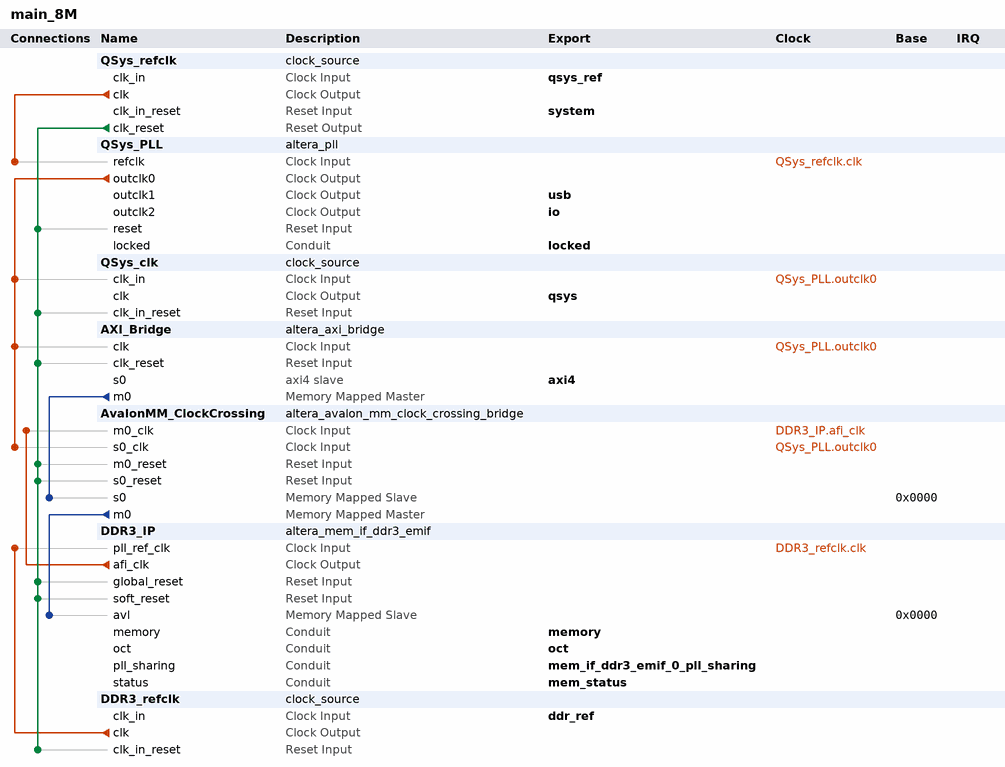
[diagram p0: system contents]
# Platform Designer (Qsys) system main_8M, Stratix V 5SGXEA7N2F45C2
# Parameters at their usual value, and those the tool derives, are not listed.
package require -exact qsys 20.1
create_system main_8M
set_project_property DEVICE_FAMILY {Stratix V}
set_project_property DEVICE 5SGXEA7N2F45C2

add_instance QSys_refclk clock_source 20.1
set_instance_parameter_value QSys_refclk clockFrequency 50000000

add_instance QSys_PLL altera_pll 20.1
set_instance_parameter_value QSys_PLL gui_device_speed_grade 1
set_instance_parameter_value QSys_PLL gui_number_of_clocks 3
set_instance_parameter_value QSys_PLL gui_operation_mode direct
set_instance_parameter_value QSys_PLL gui_output_clock_frequency0 8.0
set_instance_parameter_value QSys_PLL gui_output_clock_frequency1 48.0
set_instance_parameter_value QSys_PLL gui_output_clock_frequency2 8.0
set_instance_parameter_value QSys_PLL gui_pll_mode {Integer-N PLL}
set_instance_parameter_value QSys_PLL gui_reference_clock_frequency 50.0
set_instance_parameter_value QSys_PLL gui_use_locked true

add_instance QSys_clk clock_source 20.1
set_instance_parameter_value QSys_clk clockFrequency 50000000

add_instance AXI_Bridge altera_axi_bridge 20.1
set_instance_parameter_value AXI_Bridge ADDR_WIDTH 33
set_instance_parameter_value AXI_Bridge AXI_VERSION AXI4
set_instance_parameter_value AXI_Bridge COMBINED_ACCEPTANCE_CAPABILITY 16
set_instance_parameter_value AXI_Bridge COMBINED_ISSUING_CAPABILITY 16
set_instance_parameter_value AXI_Bridge DATA_WIDTH 32
set_instance_parameter_value AXI_Bridge M0_ID_WIDTH 4
set_instance_parameter_value AXI_Bridge READ_ACCEPTANCE_CAPABILITY 16
set_instance_parameter_value AXI_Bridge READ_ADDR_USER_WIDTH 32
set_instance_parameter_value AXI_Bridge READ_DATA_REORDERING_DEPTH 1
set_instance_parameter_value AXI_Bridge READ_DATA_USER_WIDTH 32
set_instance_parameter_value AXI_Bridge READ_ISSUING_CAPABILITY 16
set_instance_parameter_value AXI_Bridge S0_ID_WIDTH 4
set_instance_parameter_value AXI_Bridge USE_M0_ARBURST 1
set_instance_parameter_value AXI_Bridge USE_M0_ARCACHE 1
set_instance_parameter_value AXI_Bridge USE_M0_ARID 1
set_instance_parameter_value AXI_Bridge USE_M0_ARLEN 1
set_instance_parameter_value AXI_Bridge USE_M0_ARLOCK 1
set_instance_parameter_value AXI_Bridge USE_M0_ARQOS 1
set_instance_parameter_value AXI_Bridge USE_M0_ARREGION 0
set_instance_parameter_value AXI_Bridge USE_M0_ARSIZE 1
set_instance_parameter_value AXI_Bridge USE_M0_ARUSER 0
set_instance_parameter_value AXI_Bridge USE_M0_AWBURST 1
set_instance_parameter_value AXI_Bridge USE_M0_AWCACHE 1
set_instance_parameter_value AXI_Bridge USE_M0_AWID 1
set_instance_parameter_value AXI_Bridge USE_M0_AWLEN 1
set_instance_parameter_value AXI_Bridge USE_M0_AWLOCK 1
set_instance_parameter_value AXI_Bridge USE_M0_AWQOS 1
set_instance_parameter_value AXI_Bridge USE_M0_AWREGION 0
set_instance_parameter_value AXI_Bridge USE_M0_AWSIZE 1
set_instance_parameter_value AXI_Bridge USE_M0_AWUSER 0
set_instance_parameter_value AXI_Bridge USE_M0_BID 1
set_instance_parameter_value AXI_Bridge USE_M0_BRESP 1
set_instance_parameter_value AXI_Bridge USE_M0_BUSER 0
set_instance_parameter_value AXI_Bridge USE_M0_RID 1
set_instance_parameter_value AXI_Bridge USE_M0_RLAST 1
set_instance_parameter_value AXI_Bridge USE_M0_RRESP 1
set_instance_parameter_value AXI_Bridge USE_M0_RUSER 0
set_instance_parameter_value AXI_Bridge USE_M0_WSTRB 1
set_instance_parameter_value AXI_Bridge USE_M0_WUSER 0
set_instance_parameter_value AXI_Bridge USE_PIPELINE 1
set_instance_parameter_value AXI_Bridge USE_S0_ARCACHE 1
set_instance_parameter_value AXI_Bridge USE_S0_ARLOCK 1
set_instance_parameter_value AXI_Bridge USE_S0_ARPROT 1
set_instance_parameter_value AXI_Bridge USE_S0_ARQOS 1
set_instance_parameter_value AXI_Bridge USE_S0_ARREGION 0
set_instance_parameter_value AXI_Bridge USE_S0_ARUSER 0
set_instance_parameter_value AXI_Bridge USE_S0_AWCACHE 1
set_instance_parameter_value AXI_Bridge USE_S0_AWLOCK 1
set_instance_parameter_value AXI_Bridge USE_S0_AWPROT 1
set_instance_parameter_value AXI_Bridge USE_S0_AWQOS 1
set_instance_parameter_value AXI_Bridge USE_S0_AWREGION 0
set_instance_parameter_value AXI_Bridge USE_S0_AWUSER 0
set_instance_parameter_value AXI_Bridge USE_S0_BRESP 1
set_instance_parameter_value AXI_Bridge USE_S0_BUSER 0
set_instance_parameter_value AXI_Bridge USE_S0_RRESP 1
set_instance_parameter_value AXI_Bridge USE_S0_RUSER 0
set_instance_parameter_value AXI_Bridge USE_S0_WLAST 1
set_instance_parameter_value AXI_Bridge USE_S0_WUSER 0
set_instance_parameter_value AXI_Bridge WRITE_ACCEPTANCE_CAPABILITY 16
set_instance_parameter_value AXI_Bridge WRITE_ADDR_USER_WIDTH 32
set_instance_parameter_value AXI_Bridge WRITE_DATA_USER_WIDTH 32
set_instance_parameter_value AXI_Bridge WRITE_ISSUING_CAPABILITY 16
set_instance_parameter_value AXI_Bridge WRITE_RESP_USER_WIDTH 32

add_instance AvalonMM_ClockCrossing altera_avalon_mm_clock_crossing_bridge 20.1
set_instance_parameter_value AvalonMM_ClockCrossing ADDRESS_WIDTH 10
set_instance_parameter_value AvalonMM_ClockCrossing COMMAND_FIFO_DEPTH 4
set_instance_parameter_value AvalonMM_ClockCrossing DATA_WIDTH 32
set_instance_parameter_value AvalonMM_ClockCrossing MASTER_SYNC_DEPTH 2
set_instance_parameter_value AvalonMM_ClockCrossing MAX_BURST_SIZE 1
set_instance_parameter_value AvalonMM_ClockCrossing RESPONSE_FIFO_DEPTH 4
set_instance_parameter_value AvalonMM_ClockCrossing SLAVE_SYNC_DEPTH 2
set_instance_parameter_value AvalonMM_ClockCrossing USE_AUTO_ADDRESS_WIDTH 1

add_instance DDR3_IP altera_mem_if_ddr3_emif 20.1
set_instance_parameter_value DDR3_IP AVL_MAX_SIZE 8
set_instance_parameter_value DDR3_IP CALIBRATION_MODE Skip
set_instance_parameter_value DDR3_IP CPORT_TYPE_PORT Bidirectional,Bidirectional,Bidirectional,Bidirectional,Bidirectional,Bidirectional
set_instance_parameter_value DDR3_IP EXPORT_AFI_HALF_CLK false
set_instance_parameter_value DDR3_IP HARD_EMIF false
set_instance_parameter_value DDR3_IP MEM_BANKADDR_WIDTH 3
set_instance_parameter_value DDR3_IP MEM_CK_WIDTH 2
set_instance_parameter_value DDR3_IP MEM_CLK_FREQ 800.0
set_instance_parameter_value DDR3_IP MEM_CLK_FREQ_MAX 1066.667
set_instance_parameter_value DDR3_IP MEM_COL_ADDR_WIDTH 10
set_instance_parameter_value DDR3_IP MEM_DQ_WIDTH 64
set_instance_parameter_value DDR3_IP MEM_FORMAT UNBUFFERED
set_instance_parameter_value DDR3_IP MEM_ROW_ADDR_WIDTH 16
set_instance_parameter_value DDR3_IP MEM_RTT_WR RZQ/2
set_instance_parameter_value DDR3_IP MEM_TCL 7
set_instance_parameter_value DDR3_IP MEM_TFAW_NS 37.5
set_instance_parameter_value DDR3_IP MEM_TRAS_NS 37.5
set_instance_parameter_value DDR3_IP MEM_TRCD_NS 13.125
set_instance_parameter_value DDR3_IP MEM_TRFC_NS 350.625
set_instance_parameter_value DDR3_IP MEM_TRP_NS 13.125
set_instance_parameter_value DDR3_IP MEM_TRRD_NS 7.5
set_instance_parameter_value DDR3_IP MEM_TRTP_NS 7.5
set_instance_parameter_value DDR3_IP MEM_TWTR 4
set_instance_parameter_value DDR3_IP MEM_VENDOR Hynix
set_instance_parameter_value DDR3_IP MEM_WTCL 6
set_instance_parameter_value DDR3_IP PLL_LOCATION Left_Right
set_instance_parameter_value DDR3_IP POWER_OF_TWO_BUS true
set_instance_parameter_value DDR3_IP PRIORITY_PORT 0,1,1,1,1,1
set_instance_parameter_value DDR3_IP RATE Quarter
set_instance_parameter_value DDR3_IP REF_CLK_FREQ 50.0
set_instance_parameter_value DDR3_IP SPEED_GRADE 2
set_instance_parameter_value DDR3_IP TIMING_BOARD_AC_SKEW 0.0176
set_instance_parameter_value DDR3_IP TIMING_BOARD_AC_TO_CK_SKEW -0.00115
set_instance_parameter_value DDR3_IP TIMING_BOARD_DQ_TO_DQS_SKEW -9.771E-4
set_instance_parameter_value DDR3_IP TIMING_BOARD_MAX_CK_DELAY 0.43458
set_instance_parameter_value DDR3_IP TIMING_BOARD_MAX_DQS_DELAY 0.433984
set_instance_parameter_value DDR3_IP TIMING_BOARD_SKEW_BETWEEN_DQS 0.098
set_instance_parameter_value DDR3_IP TIMING_BOARD_SKEW_CKDQS_DIMM_MAX 0.09856
set_instance_parameter_value DDR3_IP TIMING_BOARD_SKEW_CKDQS_DIMM_MIN -0.00279279
set_instance_parameter_value DDR3_IP TIMING_BOARD_SKEW_WITHIN_DQS 0.0069644
set_instance_parameter_value DDR3_IP TIMING_TDH 45
set_instance_parameter_value DDR3_IP TIMING_TDQSCK 255
set_instance_parameter_value DDR3_IP TIMING_TDQSQ 100
set_instance_parameter_value DDR3_IP TIMING_TDQSS 0.27
set_instance_parameter_value DDR3_IP TIMING_TDS 10
set_instance_parameter_value DDR3_IP TIMING_TDSH 0.18
set_instance_parameter_value DDR3_IP TIMING_TDSS 0.18
set_instance_parameter_value DDR3_IP TIMING_TIH 120
set_instance_parameter_value DDR3_IP TIMING_TIS 170
set_instance_parameter_value DDR3_IP TIMING_TQSH 0.4
set_instance_parameter_value DDR3_IP USER_DEBUG_LEVEL 0

add_instance DDR3_refclk clock_source 20.1
set_instance_parameter_value DDR3_refclk clockFrequency 50000000

# connections
add_connection DDR3_IP.afi_clk AvalonMM_ClockCrossing.m0_clk clock
add_connection DDR3_refclk.clk DDR3_IP.pll_ref_clk clock
add_connection QSys_PLL.outclk0 AvalonMM_ClockCrossing.s0_clk clock
add_connection QSys_PLL.outclk0 AXI_Bridge.clk clock
add_connection QSys_PLL.outclk0 QSys_clk.clk_in clock
add_connection QSys_refclk.clk QSys_PLL.refclk clock
add_connection QSys_refclk.clk_reset AvalonMM_ClockCrossing.m0_reset reset
add_connection QSys_refclk.clk_reset AvalonMM_ClockCrossing.s0_reset reset
add_connection QSys_refclk.clk_reset AXI_Bridge.clk_reset reset
add_connection QSys_refclk.clk_reset DDR3_IP.global_reset reset
add_connection QSys_refclk.clk_reset DDR3_IP.soft_reset reset
add_connection QSys_refclk.clk_reset DDR3_refclk.clk_in_reset reset
add_connection QSys_refclk.clk_reset QSys_clk.clk_in_reset reset
add_connection QSys_refclk.clk_reset QSys_PLL.reset reset
add_connection AvalonMM_ClockCrossing.m0 DDR3_IP.avl avalon
set_connection_parameter_value AvalonMM_ClockCrossing.m0/DDR3_IP.avl baseAddress 0x0000
add_connection AXI_Bridge.m0 AvalonMM_ClockCrossing.s0 avalon
set_connection_parameter_value AXI_Bridge.m0/AvalonMM_ClockCrossing.s0 baseAddress 0x0000

# exported interfaces
add_interface axi4 axi4 slave
set_interface_property axi4 EXPORT_OF AXI_Bridge.s0
add_interface ddr_ref clock sink
set_interface_property ddr_ref EXPORT_OF DDR3_refclk.clk_in
add_interface io clock source
set_interface_property io EXPORT_OF QSys_PLL.outclk2
add_interface locked conduit end
set_interface_property locked EXPORT_OF QSys_PLL.locked
add_interface mem_if_ddr3_emif_0_pll_sharing conduit end
set_interface_property mem_if_ddr3_emif_0_pll_sharing EXPORT_OF DDR3_IP.pll_sharing
add_interface mem_status conduit end
set_interface_property mem_status EXPORT_OF DDR3_IP.status
add_interface memory conduit end
set_interface_property memory EXPORT_OF DDR3_IP.memory
add_interface oct conduit end
set_interface_property oct EXPORT_OF DDR3_IP.oct
add_interface qsys clock source
set_interface_property qsys EXPORT_OF QSys_clk.clk
add_interface qsys_ref clock sink
set_interface_property qsys_ref EXPORT_OF QSys_refclk.clk_in
add_interface system reset sink
set_interface_property system EXPORT_OF QSys_refclk.clk_in_reset
add_interface usb clock source
set_interface_property usb EXPORT_OF QSys_PLL.outclk1

set_interconnect_requirement {$system} qsys_mm.clockCrossingAdapter HANDSHAKE
set_interconnect_requirement {$system} qsys_mm.maxAdditionalLatency 1

save_system main_8M.qsys
